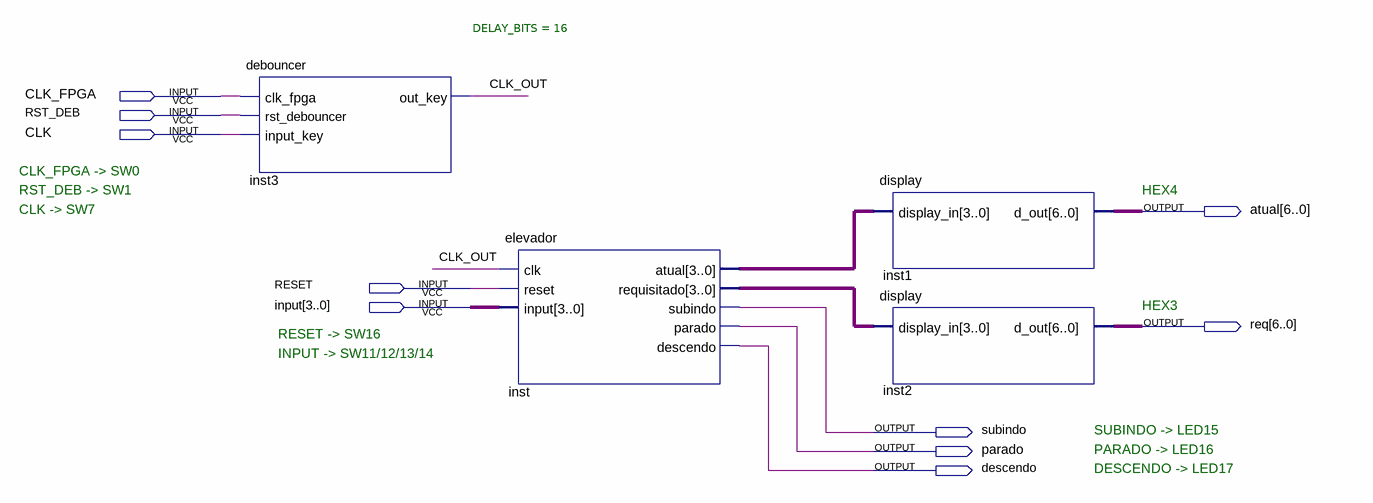
[diagram p0: schematic sheet]
// Quartus schematic bloco_elevador.bdf as structural Verilog: 4 symbols, 10 pins
module bloco_elevador (
  input  CLK_FPGA,
  input  RST_DEB,
  input  CLK,
  input  RESET,
  input  [3:0] \input ,
  output [6:0] atual,
  output [6:0] req,
  output subindo,
  output parado,
  output descendo
);

  wire CLK_OUT;
  wire [3:0] inst_atual, inst_requisitado;

  debouncer #(.DELAY_BITS(16)) inst3 (.clk_fpga(CLK_FPGA), .rst_debouncer(RST_DEB), .input_key(CLK), .out_key(CLK_OUT));
  elevador inst (
    .clk(CLK_OUT), .reset(RESET), .\input (\input ), .atual(inst_atual), .requisitado(inst_requisitado),
    .subindo(subindo), .parado(parado), .descendo(descendo));
  display inst1 (.display_in(inst_atual), .d_out(atual));
  display inst2 (.display_in(inst_requisitado), .d_out(req));

  // Notes on the sheet:
  //   CLK_FPGA -> SW0
  //   RST_DEB -> SW1
  //   HEX4
  //   CLK -> SW7
  //   HEX3
  //   RESET -> SW16
  //   INPUT -> SW11/12/13/14
  //   SUBINDO -> LED15
  //   PARADO -> LED16
  //   DESCENDO -> LED17
endmodule
